# EasyEDA Pro project ax08.eprj, schematic debugger_x8
Board Name: debugger_x8; Create Date: 2025-06-15; Page Name: P1; Project Name: rlpc; Schematic Name: debugger_x8; Update Date: 2025-06-15; Company: EasyEDA.com; Page Size: A4; Version: V1.0
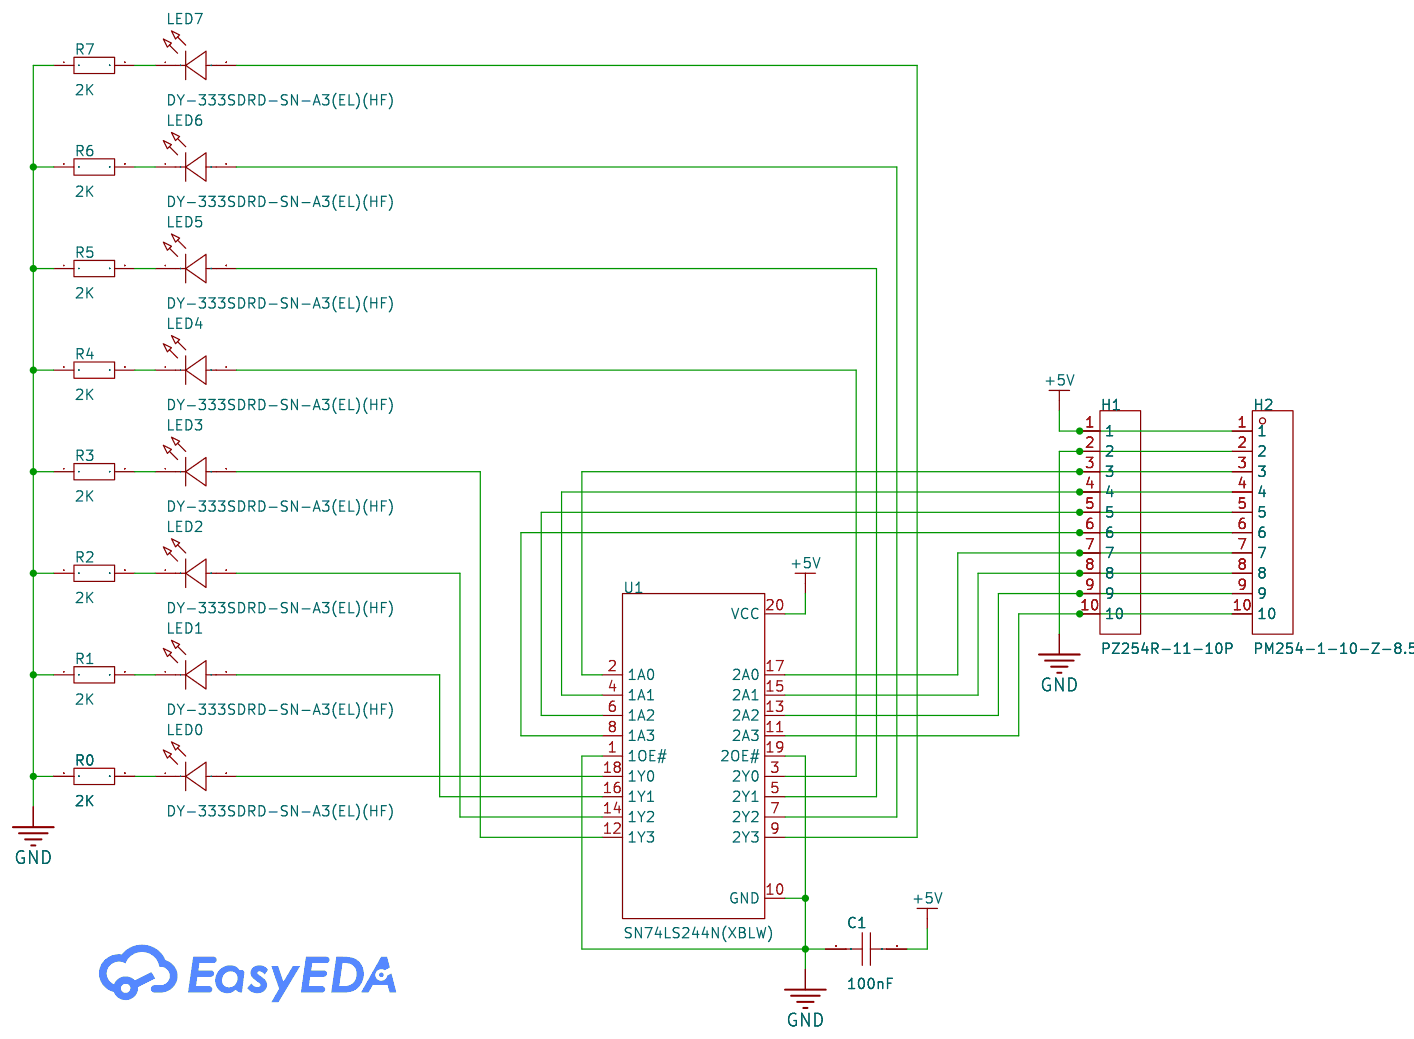
[diagram p0: schematic sheet]

## Parts
C1  100nF  [R0805_1]
H1  PZ254R-11-10P  [HDR-TH_10P-P2.54-H-M-W10.4]
H2  PM254-1-10-Z-8.5  [HDR-TH_10P-P2.54-V-F]
LED0  DY-333SDRD-SN-A3(EL)(HF)  [LED-TH_BD5.9-P2.54-RD]
LED1  DY-333SDRD-SN-A3(EL)(HF)  [LED-TH_BD5.9-P2.54-RD]
LED2  DY-333SDRD-SN-A3(EL)(HF)  [LED-TH_BD5.9-P2.54-RD]
LED3  DY-333SDRD-SN-A3(EL)(HF)  [LED-TH_BD5.9-P2.54-RD]
LED4  DY-333SDRD-SN-A3(EL)(HF)  [LED-TH_BD5.9-P2.54-RD]
LED5  DY-333SDRD-SN-A3(EL)(HF)  [LED-TH_BD5.9-P2.54-RD]
LED6  DY-333SDRD-SN-A3(EL)(HF)  [LED-TH_BD5.9-P2.54-RD]
LED7  DY-333SDRD-SN-A3(EL)(HF)  [LED-TH_BD5.9-P2.54-RD]
R0  2K  [R0805_1]
R1  2K  [R0805_1]
R2  2K  [R0805_1]
R3  2K  [R0805_1]
R4  2K  [R0805_1]
R5  2K  [R0805_1]
R6  2K  [R0805_1]
R7  2K  [R0805_1]
U1  SN74LS244N(XBLW)  [PDIP-20_L26.2-W7.6-P2.54-LS7.9-BL]

## Library data of the parts
C1 = CAP_0603: Supplier Footprint: 0603
H1 = PZ254R-11-10P: Pin Structure:1x10P Pitch:2.54mm Row Spacing:- Circluar Pins/Square Pins:Policy Mounting Type:Right-Angle Number of Rows:Single Row Number of Pins:10P Current Rating:- Voltage Rating (Max):- Length of Mating Pin:6mm Insulation Height:2.5mm Contact Materia; LCSC Part Name: 1x10P 间距:2.54mm 方针 弯插; Supplier Part: C492418; Manufacturer: XFCN(兴飞); Supplier Footprint: 弯插,P=2.54mm; JLCPCB Part Class: Extended Part; Datasheet: https://atta.szlcsc.com/upload/public/pdf/source/20200309/C492418_7D4B377DA52397FDD3F1E8B8860933B9.pdf; Supplier: LCSC; Pin Structure: 1x10P; Pitch: 2.54mm; Circluar Pins/Square Pins: Policy; Mounting Type: Right-Angle; Number of Rows: Single Row; Number of Pins: 10P; Length of Mating Pin: 6mm; Insulation Height: 2.5mm; Contact Material: Brass; Operating Temperature: -40℃~+105℃; Color: Black
H2 = PM254-1-10-Z-8.5: Holes Structure:1x10P Pitch:2.54mm Row Spacing:- Circular Hole / Square Hole:Square Holes Mounting Type:Straight Number of Rows:Plugin Number of Holes:10P Current Rating (Max):3A Voltage Rating (Max):- Holes Direction:Top Insulation Height:8.5mm Contact M; LCSC Part Name: 1x10P 间距:2.54mm 直插; Supplier Part: C2897373; Manufacturer: HCTL(华灿天禄); Supplier Footprint: 插件,P=2.54mm; JLCPCB Part Class: Extended Part; Datasheet: https://atta.szlcsc.com/upload/public/pdf/source/20230609/534BE42964C679BDE98E061007C4ABD6.pdf; Supplier: LCSC; Holes Structure: 1x10P; Pitch: 2.54mm; Circular Hole / Square Hole: Square Holes; Mounting Type: Straight; Number of Rows: Plugin; Number of Holes: 10P; Current Rating (Max): 3A; Holes Direction: Top; Insulation Height: 8.5mm; Contact Material: Copper Alloy; Operating Temperature Range: -40℃~+105℃; Soldering Temperature(Max): 260℃@5S
LED0-LED7 = DY-333SDRD-SN-A3(EL)(HF): LCSC Part Name: 5mm圆头有边深红色; Supplier Part: C7470717; Manufacturer: TONYU(东裕); Supplier Footprint: D=5mm; JLCPCB Part Class: Extended Part; Datasheet: https://atta.szlcsc.com/upload/public/pdf/source/20230726/A5026F05C18442FAA119150FE1AD85AF.pdf; Supplier: LCSC
R0-R7 = Res_0603: Supplier Footprint: 0603
U1 = Buffer: 8bit buffer; LCSC Part Name: SN74LS244是具有3态输出的8位bufter/line驱动器; Supplier Part: C42451381; Manufacturer: XBLW(芯伯乐); Supplier Footprint: DIP-20; Datasheet: https://atta.szlcsc.com/upload/public/pdf/source/20250116/6B2DF5498B379AFEA80B5D3D5587F69B.pdf; Supplier: LCSC; output type: Tri-State; Voltage - Supply: 2V~6V; Number of Elements: 1; Number of Bits per Element: 8; Channel Type: Unidirectional; Current - Output Low(IOL): 7.8mA; Current - Output High(IOH): 7.8mA; Logic Family: 74LSSeries; Operating Temperature: -20℃~+85℃

## Nets
+5V: C1.2 H1.1 H2.1 U1.20(VCC)
GND: C1.1 H1.2 H2.2 R0.1 R1.1 R2.1 R3.1 R4.1 R5.1 R6.1 R7.1 U1.1(1OE#) U1.10(GND) U1.19(2OE#)
$1N540: LED0.2(A) U1.18(1Y0)
$1N546: LED1.2(A) U1.16(1Y1)
$1N552: LED2.2(A) U1.14(1Y2)
$1N559: LED3.2(A) U1.12(1Y3)
$1N569: LED4.2(A) U1.3(2Y0)
$1N575: LED5.2(A) U1.5(2Y1)
$1N582: LED6.2(A) U1.7(2Y2)
$1N589: LED7.2(A) U1.9(2Y3)
$1N789: LED1.1(K) R1.2
$1N815: LED3.1(K) R3.2
$1N841: LED4.1(K) R4.2
$1N867: LED5.1(K) R5.2
$1N893: LED6.1(K) R6.2
$1N919: LED7.1(K) R7.2
$1N945: LED0.1(K) R0.2
$1N971: LED2.1(K) R2.2
$1N1661: H1.10 H2.10 U1.11(2A3)
$1N1713: H1.9 H2.9 U1.13(2A2)
$1N1759: H1.8 H2.8 U1.15(2A1)
$1N1799: H1.7 H2.7 U1.17(2A0)
$1N1833: H1.6 H2.6 U1.8(1A3)
$1N1861: H1.5 H2.5 U1.6(1A2)
$1N1883: H1.4 H2.4 U1.4(1A1)
$1N1899: H1.3 H2.3 U1.2(1A0)
